# Altium schematic sheet ESP32_Lightsensor_schematic.SchDoc
size A; SheetNumber: 1; SheetTotal: 1
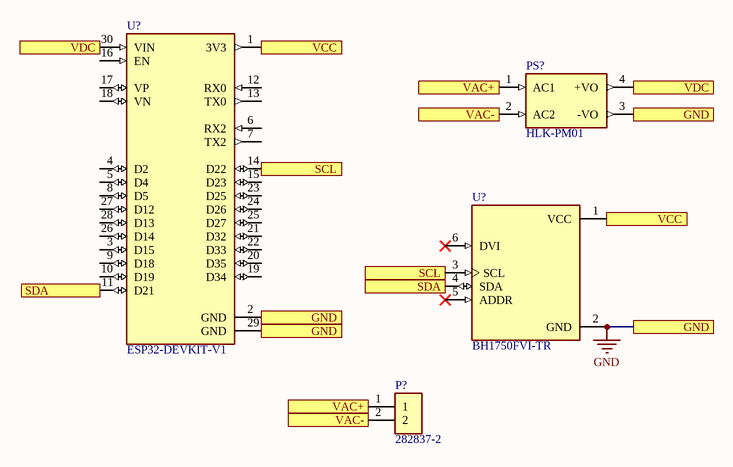
[diagram p0: ESP32_Lightsensor_schematic.SchDoc]

## Parts
(Parts that share a designator on the sheet are numbered #1, #2 ... from top to bottom, then left to right.)
P?  282837-2  [TE_282837-2]
PS?  HLK-PM01  [CONV_HLK-PM01]
U?#1  ESP32-DEVKIT-V1  [MODULE_ESP32_DEVKIT_V1]
U?#2  BH1750FVI-TR  [BH1750]

## Ports
GND, SCL, SDA, VAC+, VAC-, VCC, VDC

## Nets
GND: PS?.3(-VO) U?#1.2(GND) U?#1.29(GND) U?#2.2(GND) ; port GND
SCL: U?#1.14(D22) U?#2.3(SCL) ; port SCL
SDA: U?#1.11(D21) U?#2.4(SDA) ; port SDA
VAC+: P?.1 PS?.1(AC1) ; port VAC+
VAC-: P?.2 PS?.2(AC2) ; port VAC-
VCC: U?#1.1(3V3) U?#2.1(VCC) ; port VCC
VDC: PS?.4(+VO) U?#1.30(VIN) ; port VDC

Not connected (* = marked no-connect by the designer): U?#1 3(D15) 4(D2) 5(D4) 6(RX2) 7(TX2) 8(D5) 9(D18) 10(D19) 12(RX0) 13(TX0) 15(D23) 16(EN) 17(VP) 18(VN) 19(D34) 20(D35) 21(D32) 22(D33) 23(D25) 24(D26) 25(D27) 26(D14) 27(D12) 28(D13); U?#2 5(ADDR)* 6(DVI)*

## Library data of the parts
P? = 282837-2: TERM BLOCK 5.08MM 2POS SIDE ENTY; Value: *; Availability: Unavailable; Price: None; MP: 282837-2; Package: None
PS? = HLK-PM01: The HLK-PM01 is a small size low cost AC to DC converter which can take in 110V/220V AC at 50/60 Hz and give 5V 3W output. The module is can be used in designs which run on 5V and needs to be powered form the AC mains.; MF: Hi-link; Package: None; Price: None; Value: *; SnapEDA_Link: https://www.snapeda.com/parts/hlk-pm01/Hi-link/view-part/?ref=snap; MP: hlk-pm01; Availability: Not in stock; Check_prices: https://www.snapeda.com/parts/hlk-pm01/Hi-link/view-part/?ref=eda
U?#1 = ESP32-DEVKIT-V1: Dual core, Wi-Fi: 2.4 GHz up to 150 Mbits/s,BLE (Bluetooth Low Energy) and legacy Bluetooth, 32 bits, Up to 240 MHz; MF: Do it; Price: None; Availability: Not in stock; Package: None; MP: ESP32-DEVKIT-V1; Value: *; SnapEDA_Link: https://www.snapeda.com/parts/ESP32-DEVKIT-V1/Do+it/view-part/?ref=snap; Check_prices: https://www.snapeda.com/parts/ESP32-DEVKIT-V1/Do+it/view-part/?ref=eda
U?#2 = BH1750FVI-TR: Optical Sensor Ambient 560nm IÂ²C 6-SMD, Flat Lead Exposed Pad; MF: Rohm; Value: *; SnapEDA_Link: https://www.snapeda.com/parts/BH1750FVI-TR/Rohm/view-part/?ref=snap; Purchase-URL: https://pricing.snapeda.com/search/part/BH1750FVI-TR/?ref=eda; Availability: In Stock; Price: None; Package: SMD-6 ROHM Semiconductor; Check_prices: https://www.snapeda.com/parts/BH1750FVI-TR/Rohm/view-part/?ref=eda; MP: BH1750FVI-TR